# Altium schematic sheet _power.SchDoc: Power
size A3; DrawnBy: EISK; SheetNumber: 3; SheetTotal: 4; Version: 0.1.2; DesignStatus: Prototype
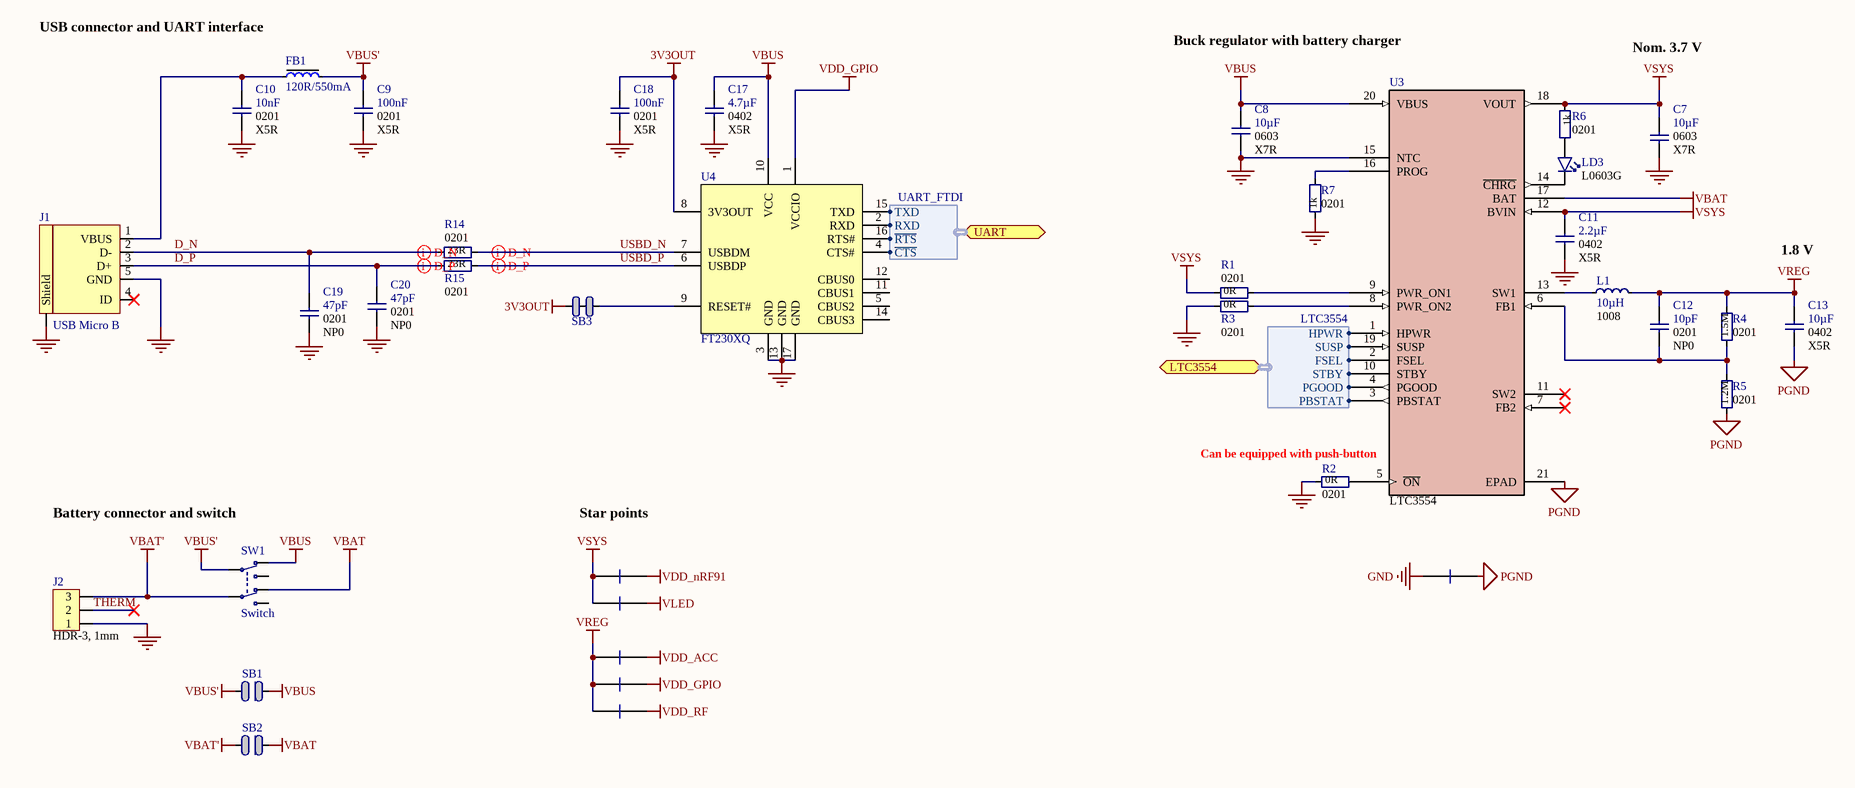
[diagram p0: _power.SchDoc]

## Parts
C7  10µF  Footprint Doc: 0603  TempCoeff: X7R  [CAPC1608X06L]
C8  10µF  Footprint Doc: 0603  TempCoeff: X7R  [CAPC1608X06L]
C9  100nF  Footprint Doc: 0201  TempCoeff: X5R  [CAPC0603X03L_C]
C10  10nF  Footprint Doc: 0201  TempCoeff: X5R  [CAPC0603X03L_C]
C11  2.2µF  Footprint Doc: 0402  TempCoeff: X5R  [CAPC1005X04L]
C12  10pF  Footprint Doc: 0201  TempCoeff: NP0  [CAPC0603X03L_C]
C13  10µF  Footprint Doc: 0402  TempCoeff: X5R  [CAPC1005X04L]
C17  4.7µF  Footprint Doc: 0402  TempCoeff: X5R  [CAPC1005X04L]
C18  100nF  Footprint Doc: 0201  TempCoeff: X5R  [CAPC0603X03L_C]
C19  47pF  Footprint Doc: 0201  TempCoeff: NP0  [CAPC0603X03L_C]
C20  47pF  Footprint Doc: 0201  TempCoeff: NP0  [CAPC0603X03L_C]
FB1  120R/550mA  [INDC1005X04L]
J1  USB Micro B  [USB-Micro-B-RA-SMD-PiP]
J2  HDR-3, 1mm  [SM03B-SRSS-TB]
L1  10µH  Footprint Doc: 1008  [IND1008]
LD3  L0603G  [LED_0603_G]
NT1  Star point  [Net_tie_GND]  (value not drawn)  (net tie, no BOM)
NT2  Star point  [Net_tie_trace]  (value not drawn)  (net tie, no BOM)
NT3  Star point  [Net_tie_trace]  (value not drawn)  (net tie, no BOM)
NT4  Star point  [Net_tie_trace]  (value not drawn)  (net tie, no BOM)
NT5  Star point  [Net_tie_trace]  (value not drawn)  (net tie, no BOM)
NT6  Star point  [Net_tie_trace]  (value not drawn)  (net tie, no BOM)
R1  0R  Footprint Doc: 0201  [RESC0603X03L_C]
R2  0R  Footprint Doc: 0201  [RESC0603X03L_C]
R3  0R  Footprint Doc: 0201  [RESC0603X03L_C]
R4  1.5M  Footprint Doc: 0201  [RESC0603X03L_C]
R5  1.2M  Footprint Doc: 0201  [RESC0603X03L_C]
R6  1k  Footprint Doc: 0201  [RESC0603X03L_C]
R7  1k  Footprint Doc: 0201  [RESC0603X03L_C]
R14  23R  Footprint Doc: 0201  [RESC0603X03L_C]
R15  23R  Footprint Doc: 0201  [RESC0603X03L_C]
SB1  Solderbridge  [Solderbridge]  (value not drawn)  (no BOM)
SB2  Solderbridge  [Solderbridge]  (value not drawn)  (no BOM)
SB3  Solderbridge  [Solderbridge_Shorted]  (value not drawn)  (net tie, no BOM)
SW1  Switch  [Switch-Slide-RA-J-Lead-DPDT-8.5x3.5mm]
U3  LTC3554  [QFN40P300X300X80_HS-21N]
U4  FT230XQ  [QFN65P400X400X80_HS-17N]

## Blocks framed on the sheet
Battery connector and switch: J2 SB1 SB2 SW1

## Ports
LTC3554 (bidir, harness LTC3554), UART (bidir, harness UART_FTDI)

## Harnesses
UART_FTDI: TXD, RXD, ~{RTS}, ~{CTS}
LTC3554: HPWR, SUSP, FSEL, STBY, PGOOD, PBSTAT

## Nets
3V3OUT: C18.1 SB3.2 U4.8(3V3OUT)
GND: C7.2 C8.2 C9.2 C10.2 C11.2 C17.2 C18.2 C19.1 C20.2 J1.5(GND) J1.6(Shield) J2.1 NT1.1 R2.1 R3.1 R7.1 U3.15(NTC) U4.3(GND) U4.13(GND) U4.17(GND)
PGND: C13.2 NT1.2 R5.1 U3.21(EPAD)
VBAT: SB2.2 SW1.6(N.C-2) U3.17(BAT)
VBAT': J2.3 SB2.1 SW1.5(COM-2)
VBUS: C8.1 C17.1 SB1.2 SW1.3(N.C-1) U3.20(VBUS) U4.10(VCC)
VBUS': C9.1 FB1.2 SB1.1 SW1.2(COM-1)
VDD_ACC: NT4.2
VDD_GPIO: NT5.2 U4.1(VCCIO)
VDD_nRF91: NT2.2
VDD_RF: NT6.2
VLED: NT3.2
VREG: C12.1 C13.1 L1.2 NT4.1 NT5.1 NT6.1 R4.2
VSYS: C7.1 C11.1 NT2.1 NT3.1 R1.1 R6.1 U3.12(BVIN) U3.18(VOUT)
D_N: C19.2 J1.2(D-) R14.1
D_P: C20.1 J1.3(D+) R15.1
THERM: J2.2
USBD_N: R14.2 U4.7(USBDM)
USBD_P: R15.2 U4.6(USBDP)
NetC10_1: C10.1 FB1.1 J1.1(VBUS)
NetC12_2: C12.2 R4.1 R5.2 U3.6(FB1)
NetL1_1: L1.1 U3.13(SW1)
NetLD3_1: LD3.1(C) U3.14(~{CHRG})
NetLD3_2: LD3.2(A) R6.2
NetR1_2: R1.2 U3.9(PWR_ON1)
NetR2_2: R2.2 U3.5(~{ON})
NetR3_2: R3.2 U3.8(PWR_ON2)
NetR7_2: R7.2 U3.16(PROG)
NetSB3_1: SB3.1 U4.9(RESET#)
NetU3_1: U3.1(HPWR) ; port LTC3554.HPWR
NetU3_2: U3.2(FSEL) ; port LTC3554.FSEL
NetU3_3: U3.3(PBSTAT) ; port LTC3554.PBSTAT
NetU3_4: U3.4(PGOOD) ; port LTC3554.PGOOD
NetU3_10: U3.10(STBY) ; port LTC3554.STBY
NetU3_19: U3.19(SUSP) ; port LTC3554.SUSP
NetU4_2: U4.2(RXD) ; port UART.RXD
NetU4_4: U4.4(CTS#) ; port UART.~{CTS}
NetU4_15: U4.15(TXD) ; port UART.TXD
NetU4_16: U4.16(RTS#) ; port UART.~{RTS}

Not connected (* = marked no-connect by the designer): J1 4(ID)*; SW1 1(N.O-1) 4(N.O-2); U3 7(FB2)* 11(SW2)*; U4 5(CBUS2) 11(CBUS1) 12(CBUS0) 14(CBUS3)

## Layout directives
differential pair; differential pair class D1: D_N, D_P, USBD_N, USBD_P

## Notes on the sheet
- (near FB1) USB connector and UART interface
- Buck regulator with battery charger
- Nom. 3.7 V
- (near U3) 500 mA charge current from USB host.
- 1.8 V
- Star points
- (near U3) Can be equipped with push-button
- Title:
- Version:
- Drawn by:
- Status:
- Size:
- Sheet
- A3
- of
- Date:
- File:

## Library data of the parts
C7 C8 = CAP:0603: Capacitor, X7R, ±10%; Note: s; Artikkelnr Noca: N.A.; Manufacturer: *; Manufacturer Part Number: *; LatestRevisionDate: 2014-11-13; Pin Count: 2; Publisher: Nordic Semiconductor; Published: 2014-11-13; Value: 10µF; HelpURL: *; Supplier 1: *; Supplier Part Number 1: *; Supplier 2: *; Supplier Part Number 2: *
C9 C10 C18 = CAP:0201: Capacitor, X5R, ±10%, 10V; Artikkelnr Noca: N.A.; Manufacturer: *; Manufacturer Part Number: *; LatestRevisionDate: 2014-11-13; Pin Count: 2; Publisher: Nordic Semiconductor; Published: 2014-11-13; HelpURL: *; Supplier 1: *; Supplier Part Number 1: *; Supplier 2: *; Supplier Part Number 2: *
  C9: Value: 100nF; Note: 10V
  C10: Value: 10nF; Note: 10V
  C18: Value: 100nF; Note: *
C11 C17 = CAP:0402: Capacitor, X5R, ±10%, 16V; Artikkelnr Noca: N.A.; Manufacturer: *; Manufacturer Part Number: *; LatestRevisionDate: 2014-11-13; Pin Count: 2; Publisher: Nordic Semiconductor; Published: 2014-11-13; Note: 16V; HelpURL: *; Supplier 1: *; Supplier Part Number 1: *; Supplier 2: *; Supplier Part Number 2: *
  C11: Value: 2.2µF
  C17: Value: 4.7µF
C12 = CAP:0201: Capacitor, NP0; Artikkelnr Noca: N.A.; Manufacturer: *; Manufacturer Part Number: *; LatestRevisionDate: 2014-11-13; Pin Count: 2; Publisher: Nordic Semiconductor; Published: 2014-11-13; Value: 10pF; Note: *; HelpURL: *; Supplier 1: *; Supplier Part Number 1: *; Supplier 2: *; Supplier Part Number 2: *
C13 = CAP:0402: Capacitor, X5R, ±20%; Note: 16V; Artikkelnr Noca: N.A.; Manufacturer: *; Manufacturer Part Number: *; LatestRevisionDate: 2014-11-13; Pin Count: 2; Publisher: Nordic Semiconductor; Published: 2014-11-13; Value: 10µF; HelpURL: *; Supplier 1: *; Supplier Part Number 1: *; Supplier 2: *; Supplier Part Number 2: *
C19 C20 = CAP:0201: Capacitor, NP0; Note: 10V; Artikkelnr Noca: N.A.; Manufacturer: *; Manufacturer Part Number: *; LatestRevisionDate: 2014-11-13; Pin Count: 2; Publisher: Nordic Semiconductor; Published: 2014-11-13; Value: 47pF; HelpURL: *; Supplier 1: *; Supplier Part Number 1: *; Supplier 2: *; Supplier Part Number 2: *
FB1 = FB0402-120R@100M-500mA: Ferrite Bead, 120 Ohm @ 100MHz, 500mA, 250 mOhm Max; Part Number: FB0805-120R@100M-550mA; Manufacturer: Murata; Manufacturer Part Number: BLM15AG121SN1D; Part number IPS: N.A.; Note: Chip EMIFIL Inductor Type Chip Ferrite Bead; Artikkelnr Noca: 33029317; Footprint Doc: 0402; LatestRevisionDate: 2019-06-06; Pin Count: 2; Publisher: Nordic Semiconductor; Published: 2011-11-14; Value: 120R/550mA; ComponentLink1Description: Datasheet; ComponentLink2URL: https://www.murata.com/en-global/products/productdata/8796733767710/S0580E.pdf; ComponentLink2Description: Datasheet; Datasheet: http://search.murata.co.jp/Ceramy/image/img/PDF/ENG/L0110S0100BLM15A_SN.pdf; Artikkelnr Simpro: N.A.; Supplier 1: Digi-Key; Supplier Part Number 1: 490-1005-1-ND
J1 = MiniUSB-AB-SMT: MicroUSB-B-SMT; Manufacturer: Amphenol ICC (FCI); Manufacturer Part Number: 10118194-0001LF; Part number IPS: 00000007790; Artikkelnr Noca: 55029020; Artikkelnr Simpro: N.A.; Part Number: USB-Micro-B-RA-SMD-PiP; Footprint Doc: USB-Micro-B-RA-SMD-PiP; LatestRevisionDate: 2016-04-21; Pin Count: 5; Publisher: Nordic Semiconductor; Published: 2014-10-07; Value: USB Micro B; Note: *; Supplier 1: Mouser; Supplier 2: Digi-Key; Supplier Part Number 1: 649-10118193-0001LF; Supplier Part Number 2: 609-4616-1-ND
J2 = CONN-3: 1.0mm pitch connector side entry SMD; Manufacturer: JST; Manufacturer Part Number: SM03B-SRSS-TB(LF)(SN); Part number IPS: 00000001785; Note: JST, Header; Artikkelnr Noca: N.A.; Part Number: SM03B-SRSS-TB; Footprint Doc: SM03B-SRSS-TB; LatestRevisionDate: 2017-10-09; Pin Count: 3; Publisher: Nordic Semiconductor; Published: 2017-10-09; Value: HDR-3, 1mm; HelpURL: http://www.jst-mfg.com/product/pdf/eng/eSH.pdf; Supplier 1: Digi-Key; Supplier Part Number 1: 455-1803-1-ND
L1 = IND:1008_REG: Switching regulator chip inductor, 2-Leads, Body 2.5x2.0x1.1 mm; Manufacturer: Wurth Electronics Inc.; Manufacturer Part Number: 74479787247; Datasheet: Not available; LatestRevisionDate: 2019-06-13; Pin Count: 2; Publisher: Nordic Semiconductor; Published: 2019-07-02; Value: 10µH; ComponentLink2Description: Supplier link; Supplier 1: Digi-Key; Supplier 2: Mouser; Supplier Part Number 1: 732-14079-1-ND; Supplier Part Number 2: 710-74479787247; ComponentLink1Description: Digi-Key
LD3 = D:LED: LED, Green, 0603, 570nm, Vf=1.7V, 2.24..5.6mcd, - 40 to +100°C; Part Number: LG L29K Smartled Green; Manufacturer: Osram; Manufacturer Part Number: LG L29K-G2J1-24-Z; Part number IPS: N.A.; Note: 2.24..5.6 mcd, Vfmin=1.7V; Artikkelnr Noca: 13019147; Footprint Doc: 0603; LatestRevisionDate: 2017-08-21; Pin Count: 2; Publisher: Nordic Semiconductor; Published: 2014-10-28; Value: L0603G; ComponentLink1URL: *; ComponentLink1Description: Datasheet; ComponentLink2URL: *; ComponentLink2Description: Supplier link; HelpURL: http://www.osram-os.com/Graphics/XPic2/00077107_0.pdf; Supplier 1: Digi-Key; Supplier Part Number 1: 475-2709-1-ND; Supplier 2: Mouser; Supplier Part Number 2: 720-LGL29KG2J124Z
NT1-NT6 = NT:Trace
R1-R7 R14 R15 = RES:0201: Manufacturer: *; Manufacturer Part Number: *; Package: 0201; Publisher: Nordic Semiconductor; LatestRevisionDate: 2019-06-11
  R1-R3: Value: 0R
  R4: Value: 1.5M
  R5: Value: 1.2M
  R6 R7: Value: 1k
  R14 R15: Value: 23R
SB1 SB2 = SOLDERBRIDGE: Note: Not in BOM; ComponentLink1URL: *; ComponentLink1Description: Datasheet; ComponentLink2URL: *; ComponentLink2Description: Supplier link; Footprint Doc: Solderbridge; Pin Count: 2; Publisher: Nordic Semiconductor; Published: 2019-07-17; Value: Solderbridge
SB3 = SOLDERBRIDGE_SHORTED: Shorted Solderbridge; Note: Not in BOM; Footprint Doc: Solderbridge Shorted; Pin Count: 2; Publisher: Nordic Semiconductor; Published: 2012-08-07; Value: Solderbridge
SW1 = SW-DPDT: SMD slide Switch (ON-ON); Part Number: Switch-Slide-RA-J-Lead-DPDT-8.5x3.5mm_Copal; Manufacturer: Copal Electronics Inc; Manufacturer Part Number: CL-SB-22A-11T; Part number IPS: 00000007811; Artikkelnr Noca: N.A.; Footprint Doc: Switch-Slide-RA-J-Lead-DPDT-8.5x3.5mm; LatestRevisionDate: 2017-02-01; Pin Count: 6; Publisher: Nordic Semiconductor; Published: 2017-02-01; Value: Switch; Note: *; HelpURL: http://www.nidec-copal-electronics.com/e/catalog/switch/cl-sb.pdf; Supplier 1: Digi-Key; Supplier Part Number 1: 563-1340-1-ND; Supplier 2: Avnet; Supplier Part Number 2: CL-SB-22A-11T
U3 = LTC3554EUD-3#PBF: IC USB POWER MANAGER 20UTQFN; Vendor: Linear Technology; Built_By: Eirik Hovde Skanke; Manufacturer_Part_Number: LTC3554EUD-3#PBF; Copyright: Nordic Semiconductor; Value: LTC3554; ComponentLink1Description: Datasheet; ComponentLink1URL: https://www.analog.com/media/en/technical-documentation/data-sheets/355412ff.pdf; ComponentLink2Description: Digi-Key; ComponentLink2URL: https://www.digikey.com/product-detail/en/linear-technology-analog-devices/LTC3554EUD-PBF/LTC3554EUD-PBF-ND/2355199
U4 = FT230X: USB Bridge, USB to UART USB 2.0 UART Interface 16-QFN (4x4); Manufacturer: FTDI; Artikkelnr Noca: N.A.; Part Number: FT230XQ; Manufacturer Part Number: FT230XQ; Footprint Doc: QFN-16; LatestRevisionDate: 2019-07-04; Pin Count: 16; Publisher: Nordic Semiconductor; Published: 2019-07-04; Value: FT230XQ; Note: *; Supplier 1: Digi-Key; Supplier Part Number 1: 768-1130-1-ND; ComponentLink1Description: Datasheet; ComponentLink1URL: https://www.ftdichip.com/Support/Documents/DataSheets/ICs/DS_FT230X.pdf